# EasyEDA schematic 1-Schematic_5_band_eq_adapter.json
TITLE: Sheet_1; REV: 1.0; Date: 2024-11-14; Sheet: 1/1; Drawn By: t.friedrich-soehner; Company: Your Company
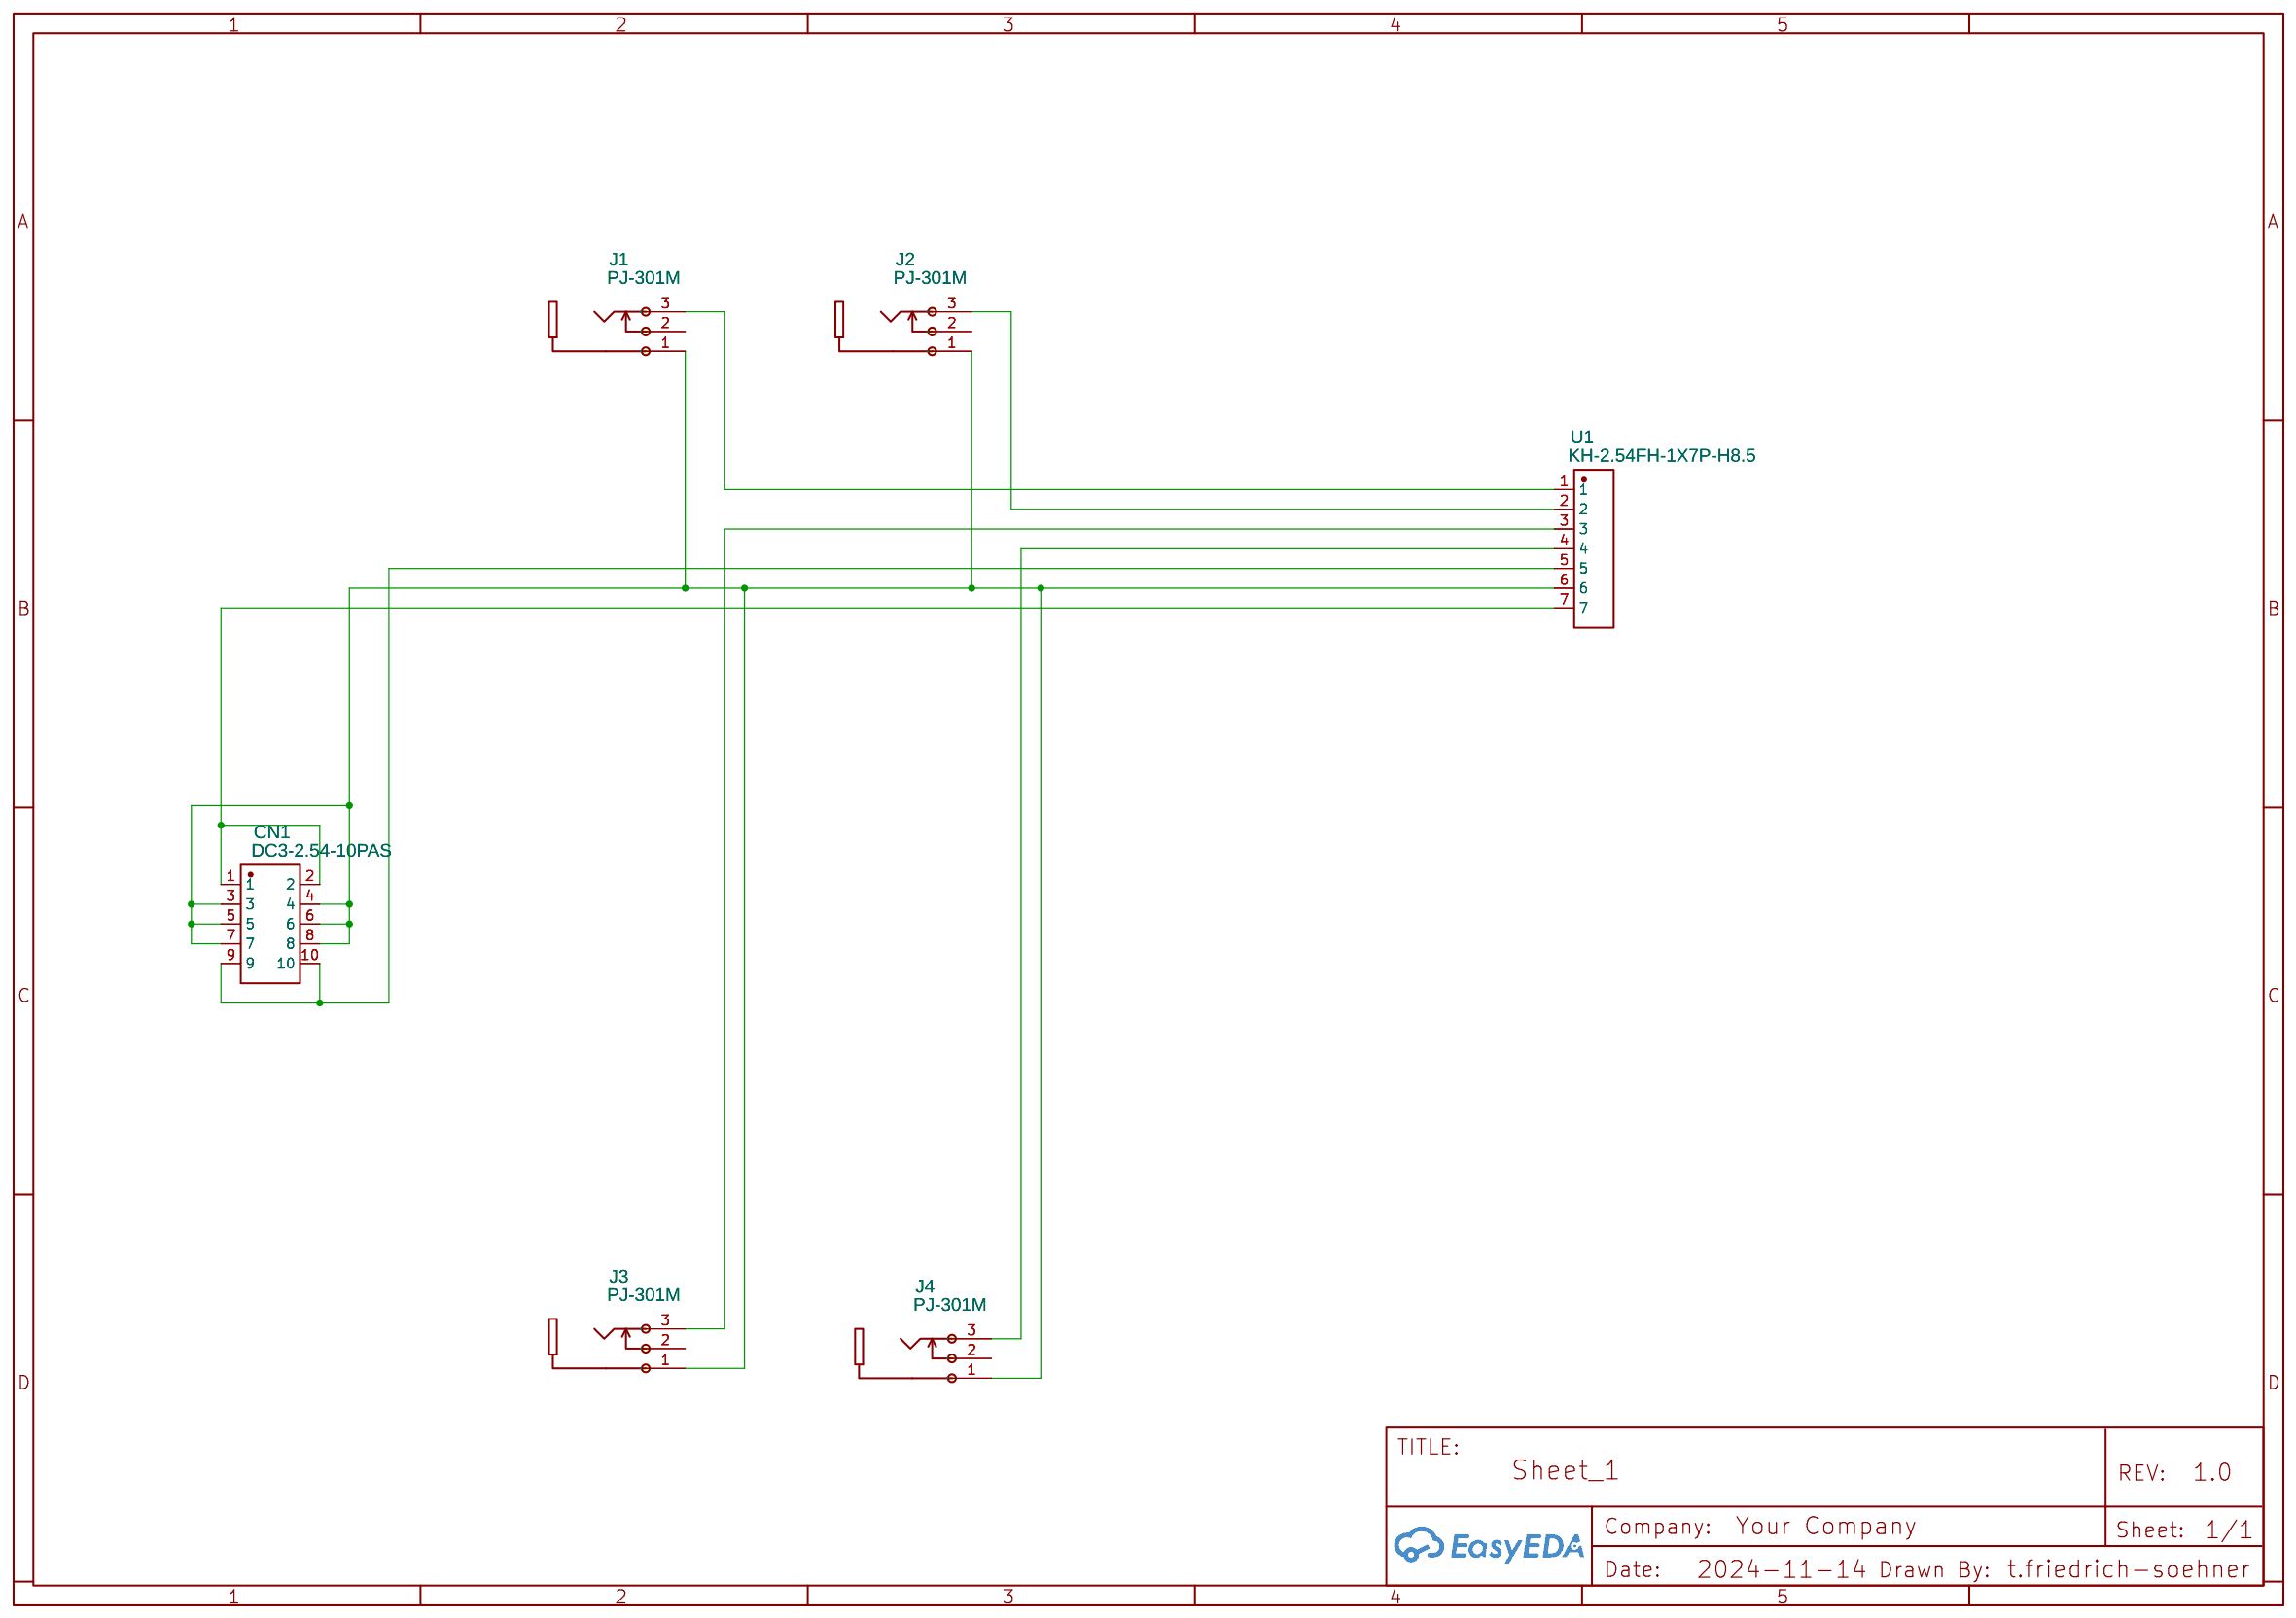
[diagram p0: schematic sheet]

## Parts
CN1  DC3-2.54-10PAS  [CONN-TH_10P-P2.54_DC3-2.54-10PAS]
J1  PJ-301M  [PJ-301M]
J2  PJ-301M  [PJ-301M]
J3  PJ-301M  [PJ-301M]
J4  PJ-301M  [PJ-301M]
U1  KH-2.54FH-1X7P-H8.5  [HDR-TH_7P-P2.54-V-F]

## Library data of the parts
CN1 = DC3-2.54-10PAS: Contributor: lcsc; Supplier: LCSC; Supplier Part: C2977596; Manufacturer: ZHOURI(洲日); JLCPCB Part Class: Extended Part
J1-J4 = PJ-301M: Supplier: Various; Contributor: Ed Random
U1 = KH-2.54FH-1X7P-H8.5: Contributor: LCSC; Supplier: LCSC; Supplier Part: C2932672; Manufacturer: kinghelm(金航标); JLCPCB Part Class: Extended Part

## Nets
Net-(CN1-1): CN1.1 CN1.2 U1.7
Net-(CN1-3): CN1.3 CN1.4 CN1.5 CN1.6 CN1.7 CN1.8 J1.1 J2.1 J3.1 J4.1 U1.6
Net-(CN1-9): CN1.9 CN1.10 U1.5
Net-(J1-3): J1.3 U1.1
Net-(J2-3): J2.3 U1.2
Net-(J3-3): J3.3 U1.3
Net-(J4-3): J4.3 U1.4

Not connected (* = marked no-connect by the designer): J1 2; J2 2; J3 2; J4 2
